# EAGLE design torikiban2020-v1 (EAGLE 9.6.1)
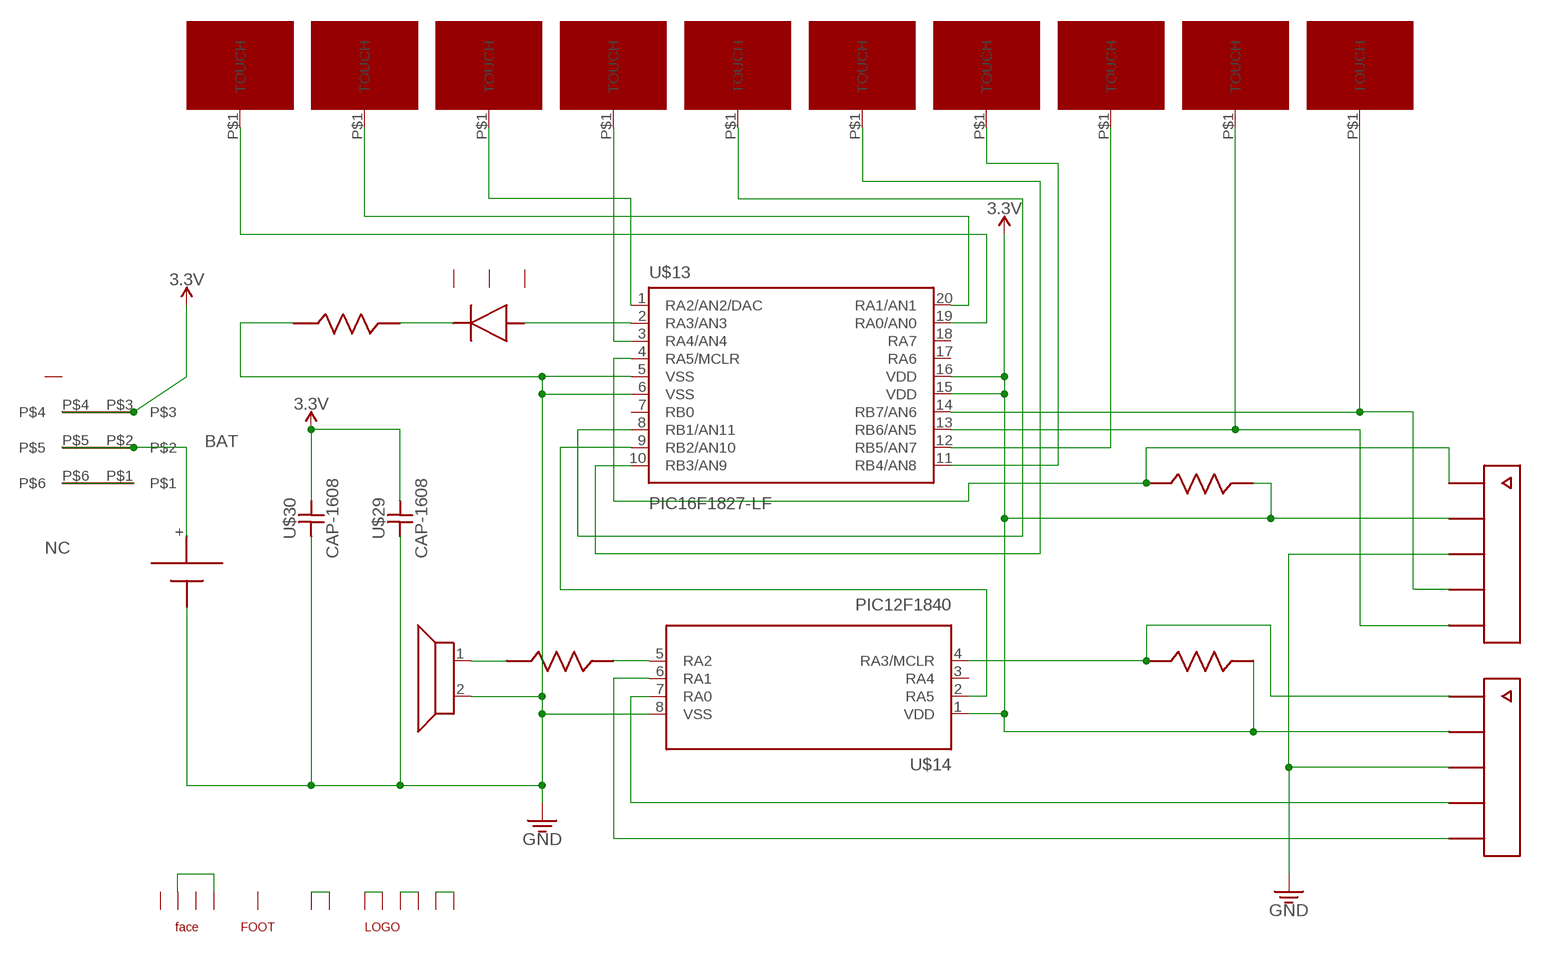
[diagram p0: schematic, sheet 1]

## Parts
U$1  TOUCH-PTN-H1  [HANE-1]
U$2  TOUCH-PTN-H2  [HANE-2]
U$3  TOUCH-PTN-H3  [HANE-3]
U$4  TOUCH-PTN-H4  [HANE-4]
U$5  TOUCH-PTN-H5  [HANE-5]
U$6  TOUCH-PTN-H6  [HANE-6]
U$7  TOUCH-PTN-H7  [HANE-7]
U$8  TOUCH-PTN-H8  [HANE-8]
U$9  TOUCH-PTN-H9  [HANE-9]
U$10  TOUCH-PTN-H10  [HANE-10]
U$13  PIC16F1827-LF  [SSOP20]
U$14  PIC12F1840  [SOIC127P600X175-8N]
U$15  FACE  [FACE]
U$16  SPEAKER  [SPEAKER]
U$17  FACE-LED  [FACE-LED]
U$18  RESISTOR-1608  [RESC1608X70N]
U$19  RESISTOR-1608  [RESC1608X70N]
U$20  RESISTOR-1608  [RESC1608X70N]
U$21  ICSP-2X  [ICSP-2X]
U$22  RESISTOR-1608  [RESC1608X70N]
U$24  PAD-FOOT  [PAD-FOOT]
U$25  CR2032-TAKACHI  [CR2032-TAKACHI]
U$26  MLOGO  [MLOGO]
U$27  SWITCH  [SSSS213202]
U$29  CAP-1608  [CAP-1608]
U$30  CAP-1608  [CAP-1608]

## Nets
3.3V: U$13.15(VDD) U$13.16(VDD) U$14.1(VDD) U$19.2 U$20.2 U$21.P$2 U$21.P$7 U$27.P$3 U$27.P$4 U$29.2 U$30.2
BAT: U$25.+ U$27.P$2 U$27.P$5
GND: U$13.5(VSS) U$13.6(VSS) U$14.8(VSS) U$16.2 U$18.1 U$21.P$3 U$21.P$8 U$25.- U$29.1 U$30.1
N$1: U$15.P$2 U$15.P$4
N$2: U$1.P$1(TOUCH) U$13.19(RA0/AN0)
N$3: U$2.P$1(TOUCH) U$13.20(RA1/AN1)
N$4: U$13.2(RA3/AN3) U$17.1
N$5: U$17.2 U$18.2
N$6: U$6.P$1(TOUCH) U$13.10(RB3/AN9)
N$7: U$3.P$1(TOUCH) U$13.1(RA2/AN2/DAC)
N$8: U$4.P$1(TOUCH) U$13.3(RA4/AN4)
N$9: U$13.9(RB2/AN10) U$14.2(RA5)
N$10: U$5.P$1(TOUCH) U$13.8(RB1/AN11)
N$11: U$7.P$1(TOUCH) U$13.11(RB4/AN8)
N$12: U$8.P$1(TOUCH) U$13.12(RB5/AN7)
N$13: U$9.P$1(TOUCH) U$13.13(RB6/AN5) U$21.P$5
N$14: U$10.P$1(TOUCH) U$13.14(RB7/AN6) U$21.P$4
N$15: U$14.5(RA2) U$22.2
N$16: U$16.1 U$22.1
N$17: U$14.4(RA3/MCLR) U$20.1 U$21.P$6
N$18: U$14.6(RA1) U$21.P$10
N$19: U$14.7(RA0) U$21.P$9
N$20: U$13.4(RA5/MCLR) U$19.1 U$21.P$1
N$26: U$26.1 U$26.2
N$27: U$26.A1 U$26.A2
N$28: U$26.R1 U$26.R2
N$29: U$26.A3 U$26.A4
NC: U$27.P$1 U$27.P$6
Unconnected: U$13.7(RB0) U$13.17(RA6) U$13.18(RA7) U$14.3(RA4) U$15.P$1 U$15.P$3 U$17.3 U$17.4 U$17.5 U$24.P$1 U$27.NC

## Library data of the parts
U$1-U$10 = Mathrax:TOUCH-PTN
U$13 = Mathrax:PIC16F1827
U$14 = Mathrax:PIC12F1840
U$15 = Mathrax:FACE
U$16 = Mathrax:SPEAKER
U$17 = Mathrax:FACE-LED
U$18-U$20 U$22 = Mathrax:RESISTOR
U$21 = Mathrax:ICSP-2X
U$24 = Mathrax:PAD-FOOT
U$25 = Mathrax:CR2032-TAKACHI
U$26 = Mathrax:MLOGO
U$27 = Mathrax:SWITCH
U$29 U$30 = Mathrax:CAP-1608

## Board
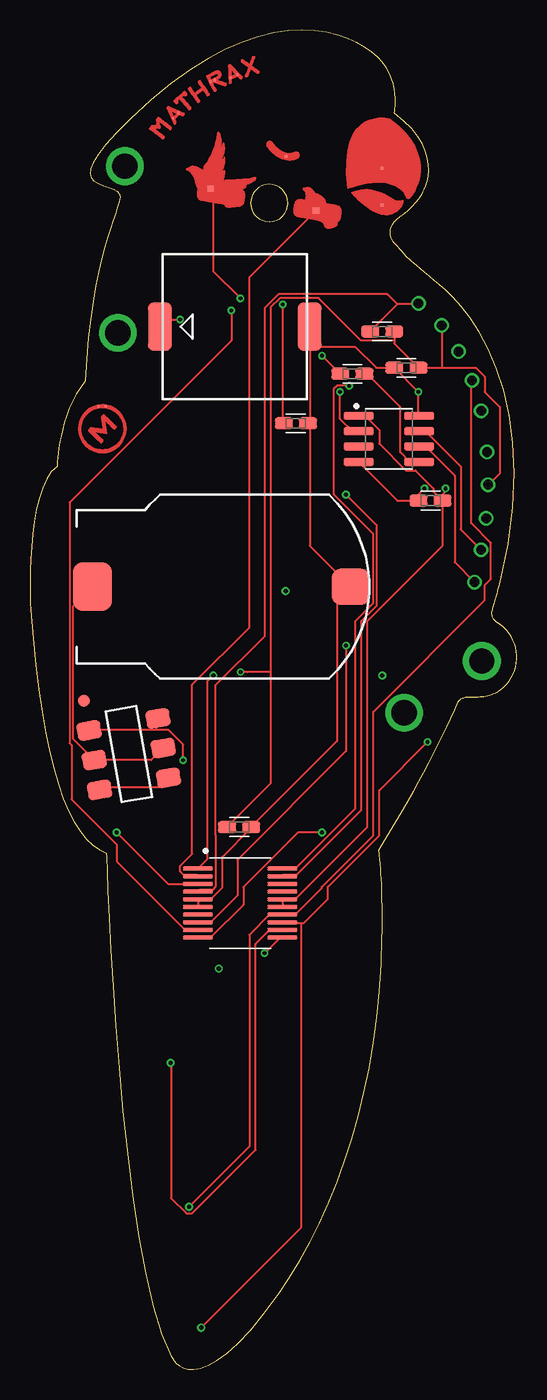
[diagram p1: board, top side]
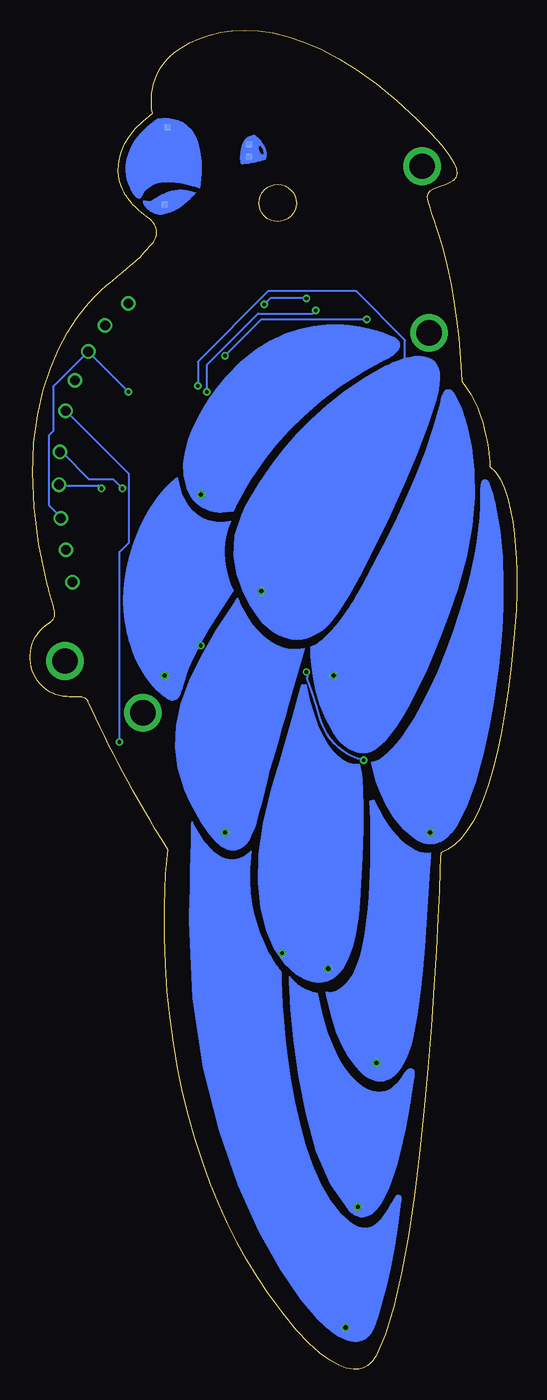
[diagram p2: board, bottom side, seen from below]

Size 40.33 x 110.92 mm. Coordinates in mm from the lower left corner, seen from the top.
Outline: 39.22,61.47 39.19,61.49 39.16,61.52 39.13,61.55 39.1,61.57 39.07,61.6 39.03,61.62 39,61.65 38.97,61.67 38.94,61.69 38.9,61.72 38.87,61.74 38.84,61.76 38.81,61.78 38.77,61.81 38.74,61.83 38.7,61.85 38.7,61.85 38.68,61.86 38.65,61.89 38.61,61.92 38.57,61.95 38.52,62 38.48,62.06 38.43,62.12 38.39,62.19 38.35,62.27 38.31,62.36 38.29,62.46 38.28,62.56 38.28,62.68 38.29,62.8 38.32,62.93 38.36,63.05 38.4,63.18 38.43,63.31 38.47,63.44 38.51,63.58 38.55,63.71 38.59,63.85 38.63,63.99 38.66,64.13 38.7,64.27 38.74,64.4 38.77,64.54 38.81,64.67 38.84,64.8 38.87,64.92 38.9,65.04 39.6,68.37 40,71.42 40.12,74.22 40.02,76.75 39.71,79.05 39.24,81.1 38.65,82.92 37.96,84.51 37.22,85.89 36.46,87.06 35.72,88.03 35.04,88.81 34.44,89.4 33.97,89.81 33.66,90.05 33.55,90.13 33.08,90.53 32.68,90.87 32.34,91.16 32.05,91.41 31.8,91.62 31.59,91.8 31.42,91.96 31.28,92.1 31.15,92.22 31.04,92.34 30.93,92.45 30.83,92.56 30.72,92.69 30.6,92.82 30.46,92.98 30.29,93.16 30.11,93.38 29.98,93.59 29.9,93.79 29.85,93.99 29.84,94.17 29.85,94.35 29.89,94.51 29.94,94.66 30.01,94.8 30.08,94.92 30.16,95.02 30.24,95.11 30.3,95.18 30.36,95.24 30.39,95.27 30.41,95.28 30.66,95.46 30.89,95.63 31.1,95.8 31.3,95.97 31.47,96.13 31.63,96.29 31.77,96.44 31.9,96.57 32.01,96.7 32.1,96.81 32.18,96.91 32.24,97 32.29,97.07 32.32,97.12 32.34,97.15 32.35,97.16 32.37,97.2 32.45,97.31 32.55,97.5 32.67,97.75 32.79,98.05 32.9,98.42 32.98,98.83 33.03,99.29 33.01,99.8 32.93,100.33 32.77,100.9 32.5,101.5 32.13,102.11 31.63,102.74 30.99,103.39 30.19,104.04 30.2,104.1 30.22,104.22 30.25,104.41 30.27,104.65 30.28,104.95 30.27,105.28 30.25,105.66 30.19,106.06 30.09,106.48 29.95,106.92 29.76,107.37 29.51,107.82 29.19,108.26 28.81,108.69 28.34,109.1 27.79,109.48 27.1,109.87 26.33,110.22 25.49,110.51 24.57,110.73 23.58,110.87 22.52,110.92 21.39,110.86 20.19,110.69 18.92,110.38 17.59,109.94 16.19,109.33 14.73,108.56 13.2,107.61 11.62,106.47 9.97,105.12 8.27,103.55 7.12,102.39 6.25,101.42 5.63,100.61 5.23,99.96 5.02,99.43 4.97,99.02 5.06,98.7 5.26,98.45 5.54,98.27 5.87,98.13 6.23,98.01 6.59,97.89 6.92,97.76 7.19,97.6 7.37,97.39 7.45,97.12 7.42,96.88 7.35,96.58 7.22,96.2 7.07,95.73 6.87,95.18 6.66,94.54 6.42,93.79 6.18,92.95 5.93,92 5.68,90.93 5.43,89.74 5.21,88.43 5,86.99 4.82,85.42 4.68,83.71 4.57,81.85 4.17,81.33 3.82,80.77 3.51,80.2 3.25,79.61 3.02,79.01 2.83,78.43 2.68,77.85 2.55,77.3 2.45,76.78 2.37,76.3 2.32,75.87 2.28,75.5 2.26,75.2 2.24,74.97 2.24,74.83 2.23,74.78 1.76,74.34 1.36,73.74 1.02,72.99 0.75,72.14 0.52,71.2 0.35,70.2 0.21,69.18 0.12,68.14 0.05,67.13 0.02,66.17 0,65.28 0,64.49 0.01,63.83 0.02,63.33 0.03,63 0.04,62.89 0.24,60.54 0.46,58.35 0.71,56.31 0.99,54.43 1.29,52.7 1.62,51.13 1.97,49.69 2.35,48.4 2.76,47.24 3.19,46.22 3.64,45.34 4.13,44.58 4.63,43.94 5.17,43.43 5.73,43.04 6.31,42.76 6.32,42.39 6.36,41.31 6.43,39.62 6.54,37.4 6.68,34.74 6.86,31.73 7.08,28.44 7.36,24.98 7.68,21.42 8.06,17.85 8.5,14.36 9,11.03 9.57,7.96 10.2,5.21 10.91,2.89 11.69,1.08 11.72,1.03 11.79,0.9 11.92,0.72 12.11,0.51 12.37,0.31 12.69,0.14 13.08,0.02 13.55,0 14.11,0.09 14.75,0.32 15.47,0.73 16.3,1.33 17.22,2.17 18.24,3.25 19.37,4.62 20.61,6.3 21.51,7.63 22.36,9.05 23.19,10.54 23.97,12.1 24.71,13.75 25.41,15.46 26.06,17.23 26.65,19.08 27.2,20.98 27.68,22.94 28.1,24.96 28.46,27.03 28.74,29.15 28.96,31.32 29.1,33.53 29.17,35.78 29.17,36.33 29.18,36.86 29.18,37.38 29.18,37.88 29.18,38.37 29.17,38.84 29.16,39.31 29.15,39.75 29.13,40.19 29.11,40.62 29.09,41.04 29.06,41.45 29.02,41.86 28.99,42.25 28.94,42.64 28.9,43.03 29.41,43.86 29.92,44.69 30.4,45.5 30.88,46.31 31.34,47.11 31.78,47.9 32.21,48.68 32.63,49.45 33.04,50.22 33.43,50.97 33.8,51.72 34.17,52.46 34.52,53.19 34.86,53.91 35.19,54.62 35.5,55.33 35.51,55.33 35.51,55.35 35.53,55.36 35.55,55.39 35.57,55.42 35.6,55.45 35.64,55.48 35.69,55.52 35.75,55.55 35.81,55.59 35.88,55.62 35.97,55.65 36.06,55.67 36.17,55.69 36.28,55.69 36.41,55.7 36.58,55.69 36.75,55.69 36.93,55.69 37.09,55.7 37.26,55.71 37.43,55.73 37.59,55.75 37.76,55.77 37.92,55.81 38.08,55.85 38.24,55.9 38.39,55.96 38.54,56.03 38.7,56.11 38.84,56.2 38.99,56.3 39.25,56.52 39.49,56.76 39.7,57.02 39.87,57.29 40.02,57.58 40.14,57.88 40.24,58.18 40.3,58.5 40.33,58.82 40.33,59.14 40.3,59.46 40.24,59.78 40.14,60.09 40.02,60.4 39.86,60.69 39.67,60.98 39.64,61.01 39.62,61.04 39.59,61.08 39.56,61.11 39.54,61.14 39.51,61.17 39.48,61.2 39.46,61.23 39.43,61.27 39.4,61.3 39.37,61.32 39.34,61.35 39.31,61.38 39.28,61.41 39.25,61.44 39.22,61.47
Outline: 18.53,95.73 18.73,95.49 18.97,95.3 19.24,95.17 19.52,95.08 19.82,95.05 20.12,95.08 20.41,95.17 20.68,95.32 20.92,95.52 21.11,95.76 21.25,96.03 21.34,96.31 21.36,96.61 21.33,96.91 21.24,97.2 21.09,97.48 20.89,97.72 20.66,97.91 20.39,98.04 20.1,98.13 19.81,98.15 19.51,98.12 19.22,98.04 18.94,97.89 18.7,97.68 18.51,97.45 18.37,97.18 18.29,96.89 18.26,96.6 18.29,96.3 18.38,96.01 18.53,95.73
Copper layers (1*16): Top 0.035mm / dielectric 1.6mm / Bottom 0.035mm
Design rules "Elecrow_2-layer_PCB_eagle_rule *": minimum track width 6mil, minimum drill 12mil, track to track 6mil, track to pad 6mil, pad to pad 6mil, via to via 8mil, smd to smd 0mil, copper to edge 20mil, drill to drill 10mil, minimum pad ring 6mil, minimum via ring 6mil, stop-mask expansion 0mil, vias tented up to drill 100mil, thermal gap 10mil

### Footprints (pad centres in the part's own frame; a part is rotated, then mirrored left to right if it is on the bottom)
HANE-1 = drill 0.35: P$1 29,75
HANE-2 = drill 0.35: P$1 24,67
HANE-3 = drill 0.35: P$1 18,60
HANE-4 = drill 0.35: P$1 10,47
HANE-5 = drill 0.35: P$1 32,60
HANE-6 = drill 0.35: P$1 27,47
HANE-7 = drill 0.35: P$1 18.46,35.73
HANE-8 = drill 0.35: P$1 14.46,27.92
HANE-9 = drill 0.35: P$1 17,6
HANE-10 = drill 0.35: P$1 16,16
SSOP20 = smd 0.35 x 2.5: 1 -2.857,-3.5; 2 -2.222,-3.5; 3 -1.587,-3.5; 4 -0.952,-3.5; 5 -0.317,-3.5; 6 0.318,-3.5; 7 0.953,-3.5; 8 1.588,-3.5; 9 2.223,-3.5; 10 2.858,-3.5; 11 2.858,3.5; 12 2.223,3.5; 13 1.588,3.5; 14 0.953,3.5; 15 0.318,3.5; 16 -0.317,3.5; 17 -0.952,3.5; 18 -1.587,3.5; 19 -2.222,3.5; 20 -2.857,3.5
SOIC127P600X175-8N = smd 2.5 x 0.65: 1 -2.5,1.905; 2 -2.5,0.635; 3 -2.5,-0.635; 4 -2.5,-1.905; 5 2.5,-1.905; 6 2.5,-0.635; 7 2.5,0.635; 8 2.5,1.905
FACE = smd 0.5 x 0.5 bottom: P$1 31.75,105.41; P$2 25,103; P$3 32,99; P$4 25,104
SPEAKER = smd 2 x 4: 1 -6.2,0; 2 6.2,0
FACE-LED = smd 0.5 x 0.5: 1 26.5,98.5; 2 17.78,100.33 | smd 0.2 x 0.2: 3 32,99; 4 32,102; 5 24,103
RESC1608X70N = smd 1.5 x 1: 1 -1,0; 2 1,0
ICSP-2X = drill 0.8: P$1 35,90.84; P$2 36.94,89.02; P$3 38.34,86.84; P$4 39.45,84.47; P$5 40.21,81.94; P$6 40.69,78.52; P$7 40.78,75.82; P$8 40.62,73.03; P$9 40.18,70.43; P$10 39.64,67.75
PAD-FOOT = drill 2.1: P$1 40.259,61.214
CR2032-TAKACHI = smd 3.2 x 4: + 10.7,0 | smd 3.2 x 3: - -10.7,0
MLOGO = smd 0.2 x 0.2: 1 8.5,82.3; 2 9.1,82.3; A1 14.68,106.16; A2 15.13,106.61; A3 19.41,109.53; A4 20.02,109.78; R1 17.78,109.2; R2 18.12,109.34
SSSS213202 = smd 1 x 1: NC 5,2.9 | smd 1.5 x 2: P$1 -2.5,-2.9; P$2 0,-2.9; P$3 2.5,-2.9; P$4 2.5,2.9; P$5 0,2.9; P$6 -2.5,2.9
CAP-1608 = smd 1.5 x 1: 1 -1,0; 2 1,0

### Placement (x,y rotation side)
U$1  -2.82,-2.54 0 top
U$2  -2.82,-2.54 0 top
U$3  -2.82,-2.54 0 top
U$4  -2.82,-2.54 0 top
U$5  -2.82,-2.54 0 top
U$6  -2.82,-2.54 0 top
U$7  -2.82,-2.54 0 top
U$8  -2.82,-2.54 0 top
U$9  -2.82,-2.54 0 top
U$10  -2.82,-2.54 0 top
U$13  17.4,38.62 270 top
U$14  29.73,77.07 0 top
U$15  -2.82,-2.54 0 top
U$16  16.96,86.36 0 top
U$17  -2.82,-2.54 0 top
U$18  22.02,78.36 180 top
U$19  29.18,85.96 0 top
U$20  33.18,71.96 0 top
U$21  -2.82,-2.54 0 top
U$22  26.7,82.46 0 top
U$24  -2.82,-2.54 0 top
U$25  15.87,64.82 180 top
U$26  -2.82,-2.54 0 top
U$27  8.18,50.96 100 top
U$29  17.32,44.92 180 top
U$30  31.18,82.96 0 top

### Tracks (layer width: path | path; a pad name or v marks a point on that pad's centre or on a via)
3.3V  (via drill 0.3)
  Top 0.152: 20.93,38.96 20.93,38.46 U$13.15 | 33.93,72.21 33.43,72.71 33.43,72.96 31.93,74.46 31.13,74.46 28.93,76.66 28.93,77.8 27.77,78.96 27.24,78.96 U$14.1 | 20.93,38.96 U$13.16 | 10.43,52.96 4.93,52.96 U$27.P$4 | 10.43,52.96 10.43,53.71 U$27.P$3 | 30.18,85.21 27.43,85.21 23.89,88.74 20.71,88.74 19.93,87.96 19.93,57.76 | U$19.2 30.18,85.21 | 30.18,85.21 30.18,84.96 U$30.2 34.18,82.96 | 34.18,82.96 36.93,82.96 37.68,82.21 37.68,80.96 38.93,79.71 38.93,74.21 38.18,73.46 U$21.P$7 | 34.18,82.96 34.18,86.46 U$21.P$2 | 19.93,57.76 18.01,57.76 v17.44,57.76 | 33.93,72.21 34.43,72.71 v34.43,72.96 | 33.93,72.21 U$20.2 34.18,68.21 27.93,61.96 27.93,44.89 21.99,38.96 20.93,38.96 | 19.93,57.76 19.93,48.53 U$29.2 | v12.68,50.46 12.68,51.75 11.47,52.96 10.43,52.96
  Bottom 0.152: v34.43,72.96 34.68,73.21 37.93,73.21 U$21.P$7 | v12.68,50.46 12.76,50.46 arc60 16.26,53.8 arc-3 17.37,57.25 arc-14 17.37,57.69 v17.44,57.76
BAT
  Top 0.152: U$27.P$2 10.03,50.46 U$27.P$5 3.57,52.21 3.57,63.22 U$25.+
GND  (via drill 0.3)
  Top 0.152: 13.93,38.96 13.93,38.46 U$13.6 | 13.93,38.96 U$13.5 | U$14.8 32.18,79.21 v32.18,80.96 U$30.1 28.68,82.96 26.93,84.71 23.18,84.71 | 23.18,84.71 23.18,86.21 U$16.2 23.18,84.71 | 23.18,84.71 23.18,78.46 U$18.1 23.18,78.21 23.18,68.21 25.43,65.96 | 25.43,65.96 26.43,64.96 U$25.- 25.43,65.96 | 25.43,65.96 25.43,52.03 U$29.1 18.32,44.85 15.93,42.46 15.93,39.89 14.99,38.96 13.93,38.96
  Bottom 0.152: v32.18,80.96 U$21.P$3 38.43,81.39 38.43,77.71 38.79,77.35 38.79,71.57 37.8,70.58 U$21.P$8
N$1
  Bottom 0.152: U$15.P$4 U$15.P$2
N$2
  Top 0.152: U$13.19 21.02,40.96 22.08,40.96 27.43,46.3 27.43,61.96 28.7,63.23 28.7,69.93 U$1.P$1
N$3  (via drill 0.3)
  Top 0.152: v26.43,81.46 26.39,81.49 25.46,81.49 25.14,81.18 25.14,72.49 28.4,69.24 28.4,63.43 26.93,61.96 26.93,46.42 21.98,41.47 U$13.20
  Bottom 0.152: U$2.P$1 9.25,76.38 9.25,85.23 13.31,89.29 20.6,89.29 26.43,83.46 v26.43,81.46
N$4
  Top 0.152: U$17.1 18.18,90.46 18.18,61.46 13.43,56.71 13.43,42.71 12.43,41.71 12.43,41.26 12.72,40.96 13.79,40.96 U$13.2
N$5  (via drill 0.3)
  Top 0.152: v17.43,88.71 15.18,90.96 15.18,97.57 U$17.2 | v20.93,88.21 20.93,78.46 U$18.2
  Bottom 0.152: v20.93,88.21 20.43,88.71 v17.43,88.71
N$6
  Top 0.152: U$6.P$1 22.19,44.46 17.68,39.94 17.68,38.47 14.97,35.76 U$13.10
N$7
  Top 0.152: U$3.P$1 14.68,56.96 14.68,42.25 U$13.1
N$8
  Top 0.152: U$13.3 11.43,40.21 U$4.P$1
N$9  (via drill 0.3)
  Top 0.152: v16.68,87.71 16.68,85.21 3.26,71.79 3.26,51.87 3.43,51.71 3.43,47.21 7.18,43.46 7.18,42.06 12.78,36.46 13.84,36.46 U$13.9 | U$14.2 26.69,77.71 25.68,78.72 v25.68,80.96
  Bottom 0.152: v16.68,87.71 16.93,87.46 21.43,87.46 25.68,83.21 v25.68,80.96
N$10  (via drill 0.3)
  Top 0.152: v26.18,59.96 26.18,51.21 17.18,42.21 17.18,39.24 14.97,37.03 U$13.8
  Bottom 0.152: v26.18,59.96 28.68,57.46 U$5.P$1
N$11  (via drill 0.3)
  Top 0.152: v19.43,34.46 20.73,35.76 U$13.11
  Bottom 0.152: v19.43,34.46 18.18,33.21 15.68,33.21 U$7.P$1
N$12
  Top 0.152: U$8.P$1 11.68,25.34 11.68,14.17 12.95,12.9 13.41,12.9 18.68,18.17 18.68,35.23 19.84,36.39 U$13.12
N$13  (via drill 0.3)
  Top 0.152: v32.93,51.96 28.93,47.96 28.93,44.21 24.68,39.96 24.68,38.96 22.68,36.96 22.43,36.96 | 22.43,36.96 20.93,36.96 U$13.13 | U$9.P$1 22.43,11.71 22.43,36.96
  Bottom 0.152: v32.93,51.96 32.93,67.71 32.14,68.49 32.14,74.15 U$21.P$5
N$14
  Top 0.152: U$10.P$1 18.18,18.46 18.18,36 19.84,37.66 U$13.14 20.95,37.71 22.01,37.71 24.18,39.87 24.18,39.96 28.43,44.21 28.43,54.46 37.68,63.71 37.68,64.96 38.19,65.47 38.19,68.45 36.56,70.08 36.56,81.86 U$21.P$4
N$15
  Top 0.152: U$22.2 27.93,82.46 30.68,79.71 30.68,75.96 31.43,75.21 32.18,75.21 U$14.5
N$16  (via drill 0.3)
  Top 0.152: v24.18,83.96 25.68,82.46 U$22.1 | v12.43,86.96 10.93,86.96 10.93,86.46 U$16.1
  Bottom 0.152: v24.18,83.96 21.18,86.96 v12.43,86.96
N$17  (via drill 0.3)
  Top 0.152: v32.68,72.96 32.18,72.46 U$20.1 30.43,71.96 U$14.4
  Bottom 0.152: v32.68,72.96 33.43,73.71 35.43,73.71 37.68,75.96 U$21.P$6
N$18
  Top 0.152: U$14.6 32.45,76.21 32.98,76.21 35.18,74.01 35.18,66.85 U$21.P$10
N$19
  Top 0.152: U$14.7 32.47,77.46 33,77.46 35.68,74.78 35.68,69.57 U$21.P$9
N$20
  Top 0.152: 30.43,88.21 U$19.1 | 30.43,88.21 32.18,88.21 U$21.P$1 | U$13.4 14.04,39.71 15.1,39.71 15.38,39.99 15.38,44.25 15.34,44.29 15.34,56.62 19.43,60.71 19.43,87.89 20.58,89.04 29.59,89.04 30.43,88.21
N$21  (via drill 2.1)
  other vias: 31,54.38
N$23  (via drill 2.1)
  other vias: 7.85,99.66
N$24  (via drill 2.1)
  other vias: 7.28,85.86
N$26
  Top 0.152: U$26.1 U$26.2
N$27
  Top 0.152: U$26.A1 U$26.A2
N$28
  Top 0.152: U$26.R1 U$26.R2
N$29
  Top 0.152: U$26.A3 U$26.A4
NC
  Top 0.152: U$27.P$6 5.97,48.21 10.68,48.21 U$27.P$1